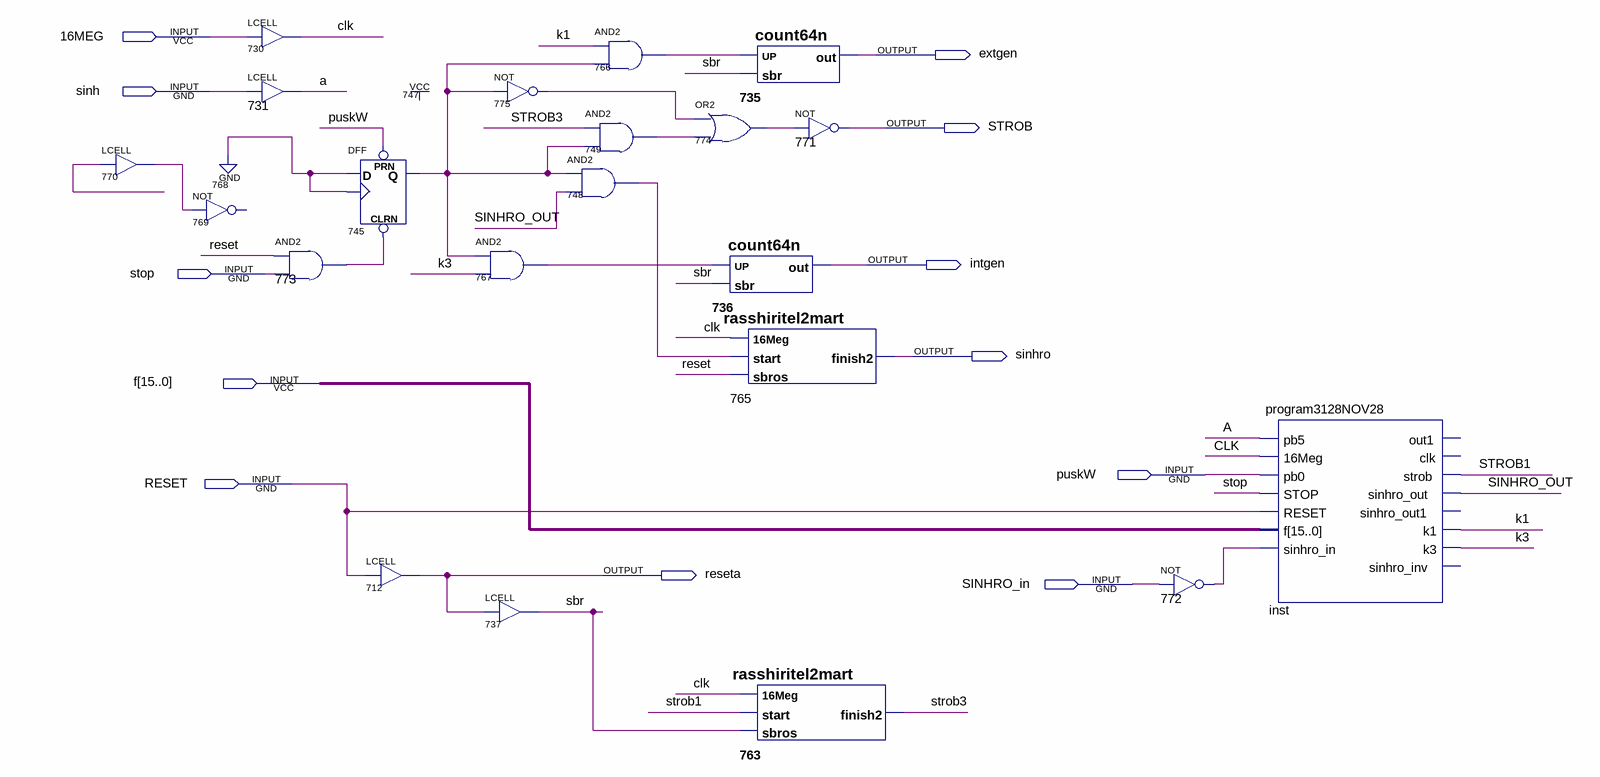
[diagram p0: schematic sheet]
// Quartus schematic program_low235aug3128.bdf as structural Verilog: 21 symbols, 12 pins
module program_low235aug3128 (
  input  \16MEG ,
  input  sinh,
  input  stop,
  input  [15:0] f,
  input  puskW,
  input  RESET,
  input  SINHRO_in,
  output extgen,
  output STROB,
  output intgen,
  output sinhro,
  output reseta
);

  wire a, clk, k1, k3, n745_q, n748_out, n749_out, n766_out, n767_out, n770_out, n772_out, n773_out,
       n774_out, n775_out, sbr, SINHRO_OUT, strob1, STROB3, undriven;

  LCELL u_770 (.IN(undriven), .OUT(n770_out));
  // NOT 769 has open pins: IN=n770_out, OUT=open
  LCELL u_730 (.IN(\16MEG ), .OUT(clk));
  LCELL u_731 (.IN(sinh), .OUT(a));
  and u_773 (n773_out, RESET, stop);
  DFF u_745 (.CLRN(n773_out), .CLK(1'b0), .D(1'b0), .PRN(puskW), .Q(n745_q));
  LCELL u_712 (.IN(RESET), .OUT(reseta));
  not u_775 (n775_out, n745_q);
  and u_767 (n767_out, n745_q, k3);
  LCELL u_737 (.IN(reseta), .OUT(sbr));
  and u_766 (n766_out, k1, n745_q);
  and u_749 (n749_out, STROB3, n745_q);
  and u_748 (n748_out, n745_q, SINHRO_OUT);
  count64n u_735 (.UP(n766_out), .sbr(sbr), .out(extgen));
  or u_774 (n774_out, n775_out, n749_out);
  count64n u_736 (.UP(n767_out), .sbr(sbr), .out(intgen));
  rasshiritel2mart u_765 (.\16Meg (clk), .start(n748_out), .sbros(RESET), .finish2(sinhro));
  rasshiritel2mart u_763 (.\16Meg (clk), .start(strob1), .sbros(sbr), .finish2(STROB3));
  not u_771 (STROB, n774_out);
  not u_772 (n772_out, SINHRO_in);
  program3128NOV28 inst (
    .pb5(a), .\16Meg (clk), .pb0(puskW), .STOP(stop), .RESET(RESET), .f(f), .sinhro_in(n772_out),
    .strob(strob1), .sinhro_out(SINHRO_OUT), .k1(k1), .k3(k3));  // open: out1, clk, sinhro_out1, sinhro_inv
endmodule
